# Altium project schematic_and_pcb.PrjPcb
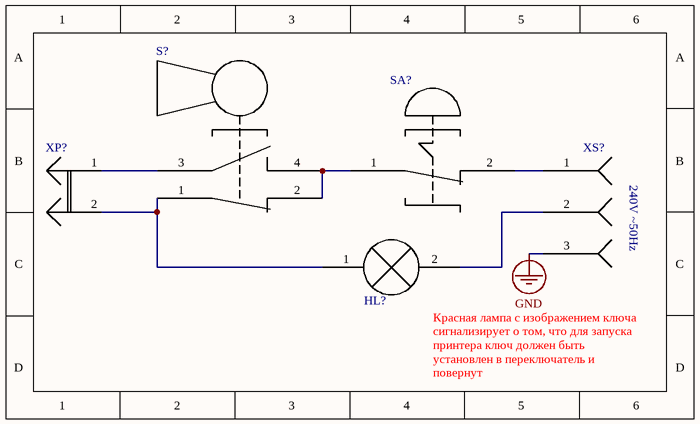
[diagram p0: 16_Key_and_Emergency.SchDoc]
1 sheet, 5 parts. Net scope: global (net labels, ports and power ports of the same name join across sheets).

## Sheet 16_Key_and_Emergency.SchDoc
size 127 x 76 mm; SheetNumber: 1; SheetTotal: 1

### Parts
HL?  Lamp  (value not drawn)
S?  1NC_1NO_S  (value not drawn)
SA?  1NC_SA  (value not drawn)
XP?  XP_2M  (value not drawn)
XS?  XS_3F  (value not drawn)

### Nets
GND: XS?.3(G)
NetHL?_1: HL?.1(L) S?.1(COM1) XP?.2(OUT2)
NetHL?_2: HL?.2(N) XS?.2(N)
NetS?_2: S?.2(NC1) S?.4(NO2) SA?.1(COM)
NetS?_3: S?.3(COM2) XP?.1(OUT1)
NetSA?_2: SA?.2(NC) XS?.1(L)

### Notes on the sheet
- (near XS?) 240V ~50Hz
- Красная лампа с изображением ключа сигнализирует о том, что для запуска принтера ключ должен быть установлен в переключатель и повернут